# Altium schematic sheet mems.SchDoc
size A3
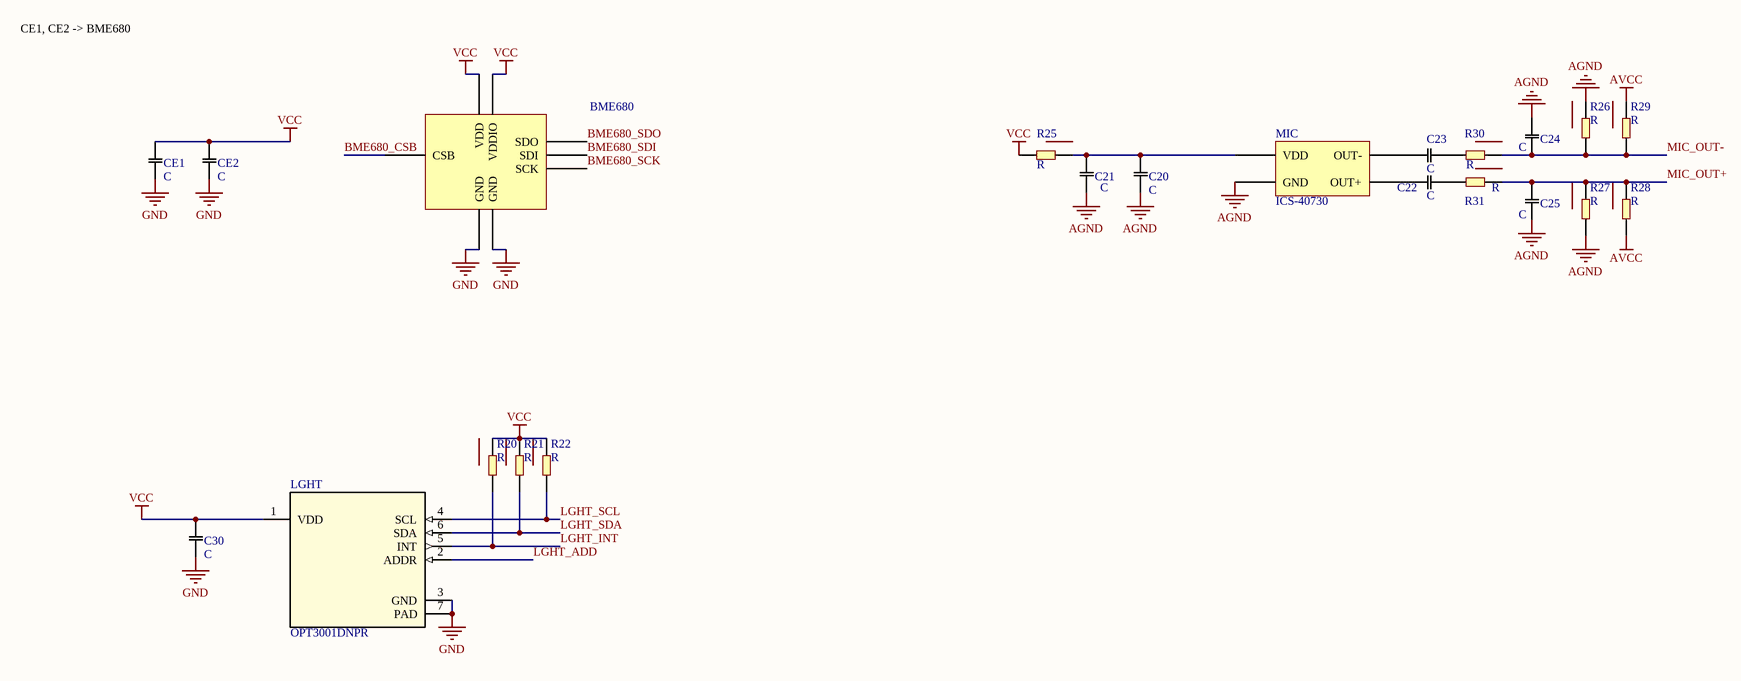
[diagram p0: mems.SchDoc]

## Parts
BME680  (no value)  [BME680]
C20  C  [402]
C21  C  [402]
C22  C  [402]
C23  C  [402]
C24  C  [402]
C25  C  [402]
C30  C  [402]
CE1  C  [402]
CE2  C  [402]
LGHT  OPT3001DNPR  [DNP0006A]
MIC  ICS-40730  [ICS-40730]
R20  R  [402]
R21  R  [402]
R22  R  [402]
R25  R  [603]
R26  R  [402]
R27  R  [402]
R28  R  [402]
R29  R  [402]
R30  R  [402]
R31  R  [402]

## Nets
AGND: C20.1 C21.1 C24.2 C25.1 MIC.4(GND) R26.2 R27.1
AVCC: R28.1 R29.2
GND: BME680.1(GND) BME680.7(GND) C30.1 CE1.1 CE2.1 LGHT.3(GND) LGHT.7(PAD)
VCC: BME680.6(VDDIO) BME680.8(VDD) C30.2 CE1.2 CE2.2 LGHT.1(VDD) R20.2 R21.2 R22.2 R25.1
BME680_CSB: BME680.2(CSB)
BME680_SCK: BME680.4(SCK)
BME680_SDI: BME680.3(SDI)
BME680_SDO: BME680.5(SDO)
LGHT_ADD: LGHT.2(ADDR)
LGHT_INT: LGHT.5(INT) R20.1
LGHT_SCL: LGHT.4(SCL) R22.1
LGHT_SDA: LGHT.6(SDA) R21.1
MIC_OUT+: C25.2 R27.2 R28.2 R31.2
MIC_OUT-: C24.1 R26.1 R29.1 R30.2
NetC20_2: C20.2 C21.2 MIC.1(VDD) R25.2
NetC22_1: C22.1 R31.1
NetC22_2: C22.2 MIC.3(OUT+)
NetC23_1: C23.1 R30.1
NetC23_2: C23.2 MIC.2(OUT-)

## Notes on the sheet
- CE1, CE2 -> BME680

## Library data of the parts
BME680 = BME680
C20-C25 C30 CE1 CE2 = C: Capacitor
LGHT = OPT3001DNPR: Imported; Manufacturer: Texas Instruments; CompType: IC; PIN_COUNT: 7; Application_BuildNumber: *; PartNumber: OPT3001DNP; PackageReference: DNP0006A; MountType: SMT; RoHS: Y; RefDes: RefDes; TYPE: TYPE; Value: Value
R20-R22 R25-R31 = R: Resistor